# Altium project ChristmasLightController.PrjPCB
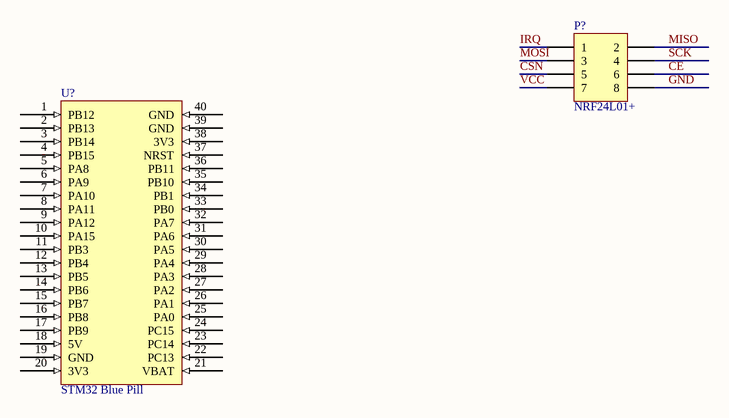
[diagram p0: Controller.SchDoc]
1 sheet, 2 parts. Net scope: global (net labels, ports and power ports of the same name join across sheets).

## Sheet Controller.SchDoc
size A

### Parts
P?  NRF24L01+  [HDR2X4]
U?  STM32 Blue Pill

### Nets
CE: P?.6
CSN: P?.5
GND: P?.8
IRQ: P?.1
MISO: P?.2
MOSI: P?.3
SCK: P?.4
VCC: P?.7

Not connected (* = marked no-connect by the designer): U? 1(PB12) 2(PB13) 3(PB14) 4(PB15) 5(PA8) 6(PA9) 7(PA10) 8(PA11) 9(PA12) 10(PA15) 11(PB3) 12(PB4) 13(PB5) 14(PB6) 15(PB7) 16(PB8) 17(PB9) 18(5V) 19(GND) 20(3V3) 21(VBAT) 22(PC13) 23(PC14) 24(PC15) 25(PA0) 26(PA1) 27(PA2) 28(PA3) 29(PA4) 30(PA5) 31(PA6) 32(PA7) 33(PB0) 34(PB1) 35(PB10) 36(PB11) 37(NRST) 38(3V3) 39(GND) 40(GND)

### Library data of the parts
P? = Header 4X2: Header, 4-Pin, Dual row; LatestRevisionDate: 17-Jul-2002; LatestRevisionNote: Re-released for DXP Platform.; Publisher: Altium Limited
U? = BluePill: STM32F103 Blue Pill